# EasyEDA schematic SCH-CJ4-autopilot-v2.json
TITLE: WT Cessna Citation CJ 4 Autopilot; REV: 1.0; Date: 2021-02-20; Sheet: 1/1; Drawn By: tuomas.kuosmanen; Company: Your Company
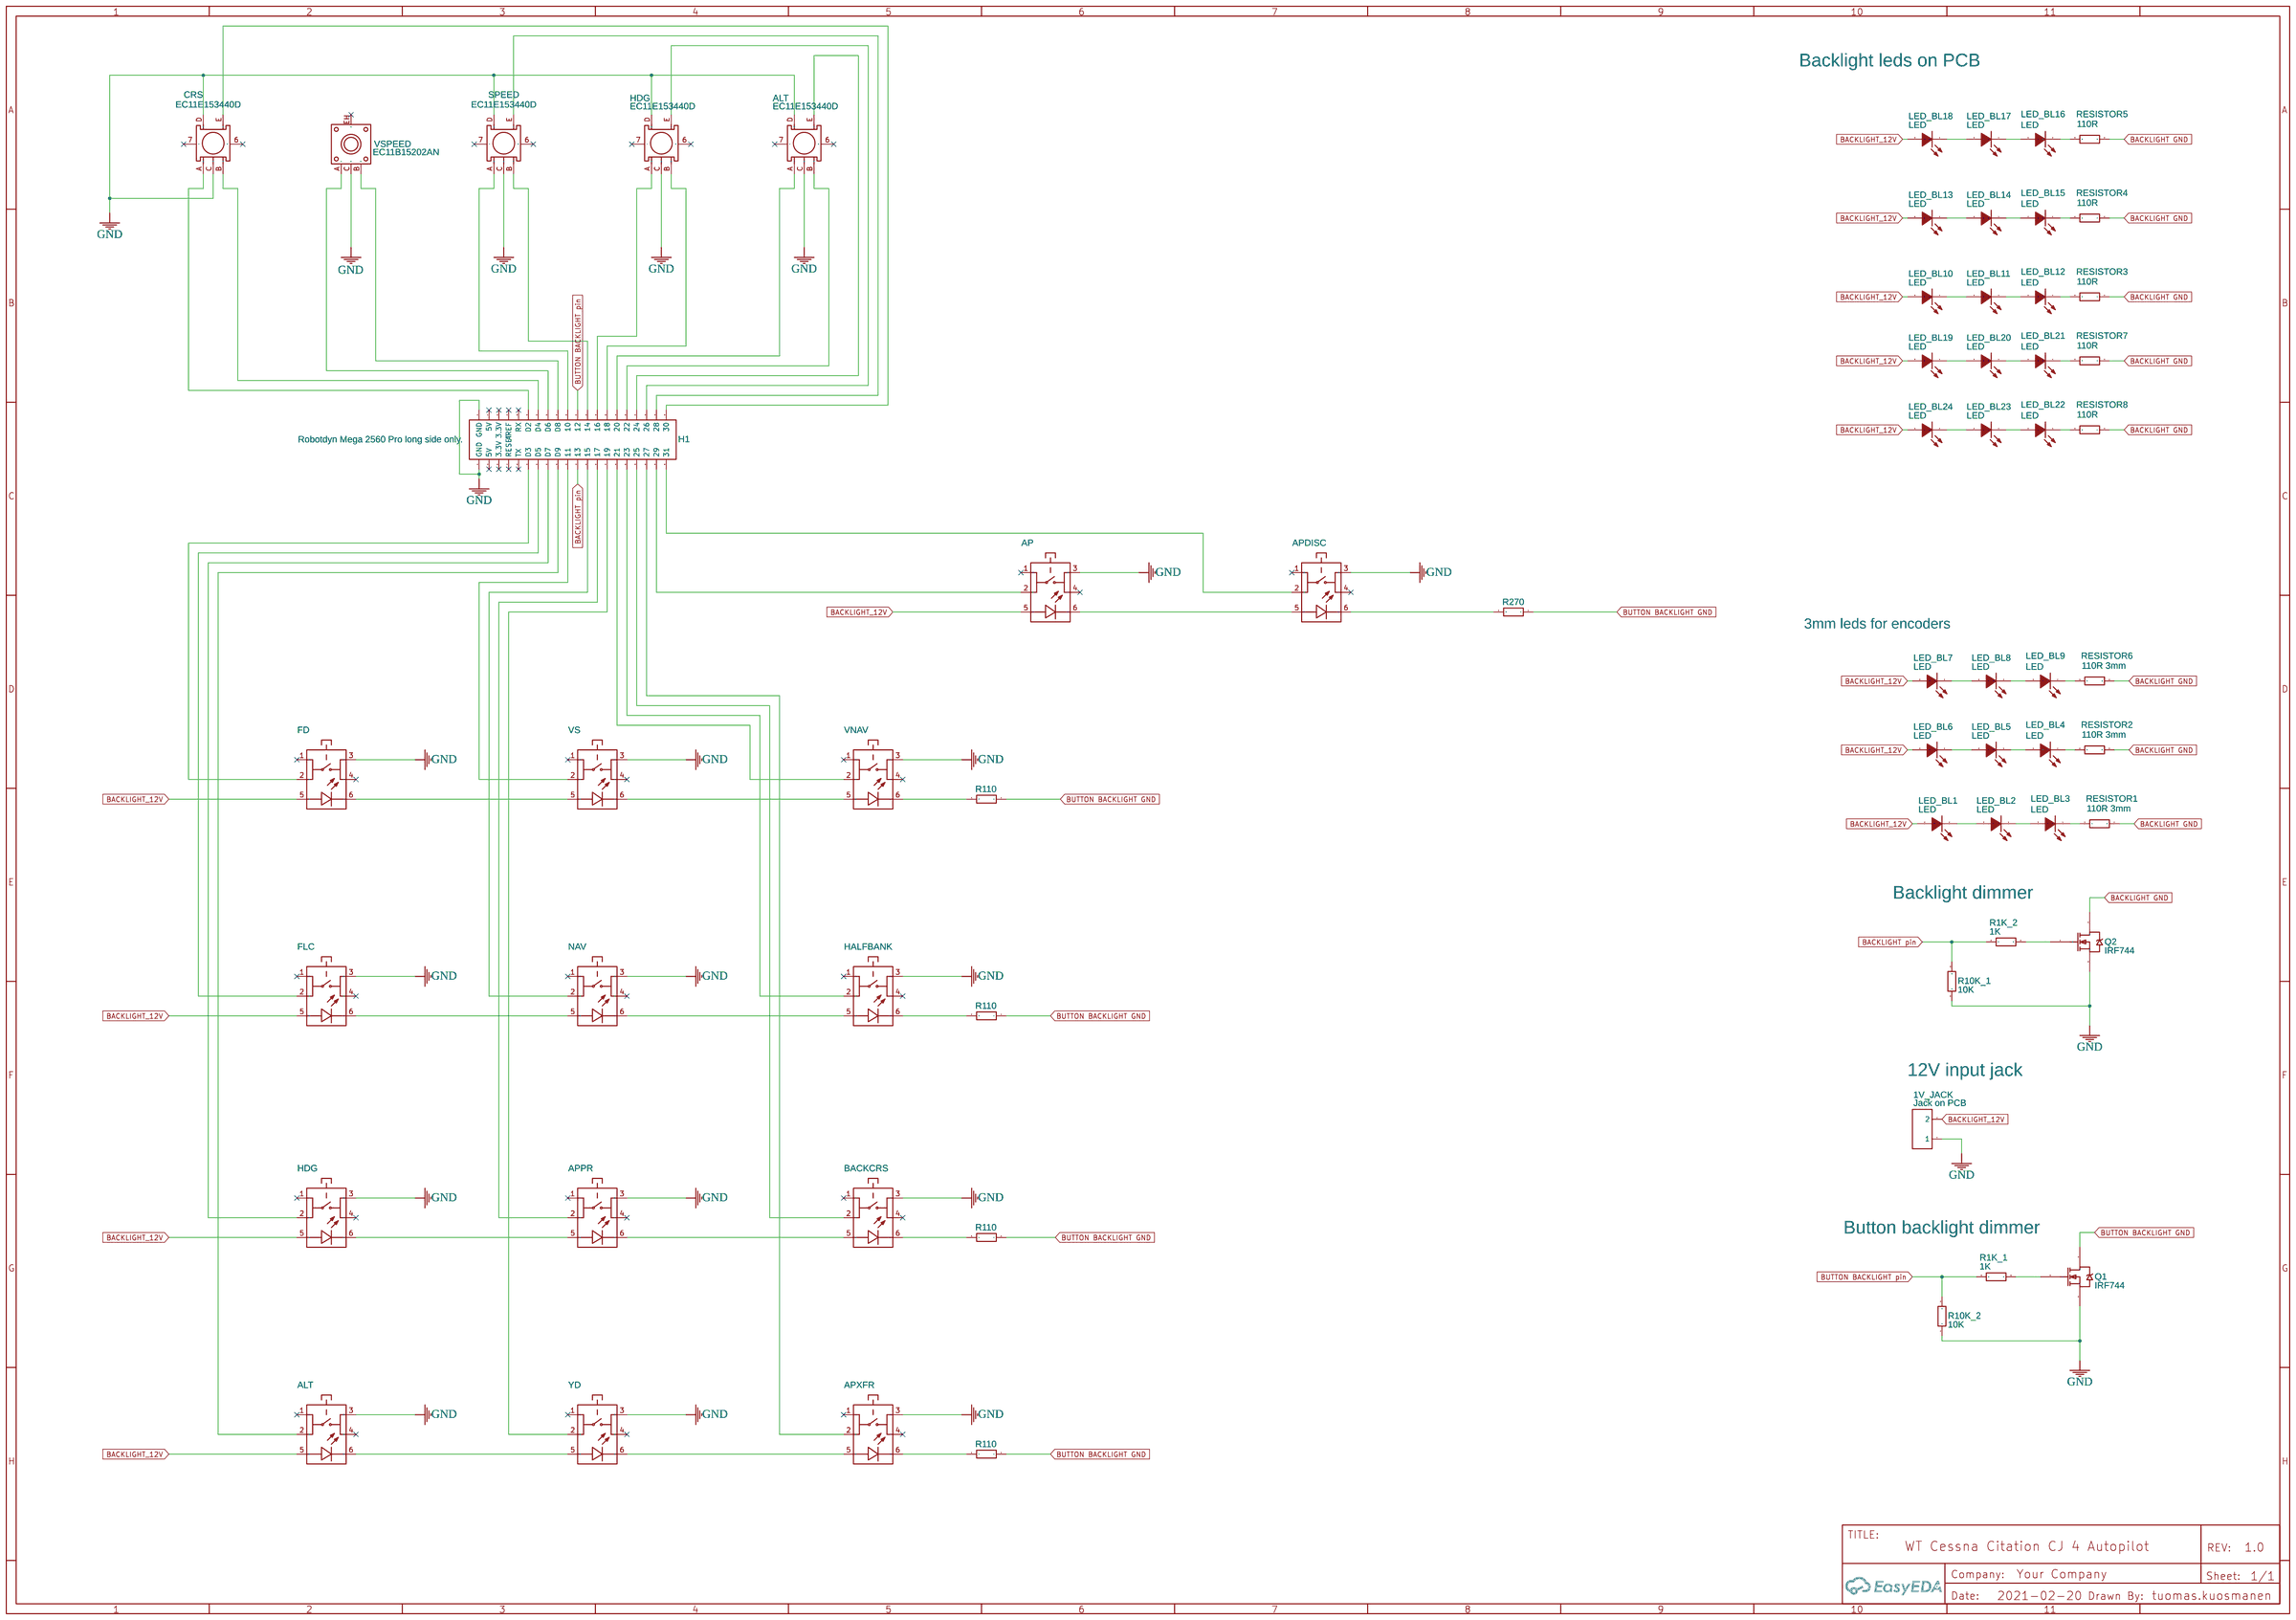
[diagram p0: schematic sheet]

## Parts
1V_JACK  Jack on PCB  [JACK ON PCB]
ALT  EC11E153440D  [SW-TH_EC11XXXXXXXX]
CRS  EC11E153440D  [SW-TH_EC11XXXXXXXX]
H1  Robotdyn Mega 2560 Pro long side only.  [HDR-TH_40P-P2.54-V-M-R2-C20-S2.54]
HDG  EC11E153440D  [SW-TH_EC11XXXXXXXX]
HEADING_HOLD1  FD  [MULTIMEC 3FTH980 - KEY SWITCH, 50 MA, 24 VDC, MEC]
HEADING_HOLD2  FLC  [MULTIMEC 3FTH980 - KEY SWITCH, 50 MA, 24 VDC, MEC]
HEADING_HOLD3  NAV  [MULTIMEC 3FTH980 - KEY SWITCH, 50 MA, 24 VDC, MEC]
HEADING_HOLD4  VS  [MULTIMEC 3FTH980 - KEY SWITCH, 50 MA, 24 VDC, MEC]
HEADING_HOLD5  HALFBANK  [MULTIMEC 3FTH980 - KEY SWITCH, 50 MA, 24 VDC, MEC]
HEADING_HOLD6  VNAV  [MULTIMEC 3FTH980 - KEY SWITCH, 50 MA, 24 VDC, MEC]
HEADING_HOLD7  HDG  [MULTIMEC 3FTH980 - KEY SWITCH, 50 MA, 24 VDC, MEC]
HEADING_HOLD8  APPR  [MULTIMEC 3FTH980 - KEY SWITCH, 50 MA, 24 VDC, MEC]
HEADING_HOLD9  BACKCRS  [MULTIMEC 3FTH980 - KEY SWITCH, 50 MA, 24 VDC, MEC]
HEADING_HOLD10  ALT  [MULTIMEC 3FTH980 - KEY SWITCH, 50 MA, 24 VDC, MEC]
HEADING_HOLD11  YD  [MULTIMEC 3FTH980 - KEY SWITCH, 50 MA, 24 VDC, MEC]
HEADING_HOLD12  APXFR  [MULTIMEC 3FTH980 - KEY SWITCH, 50 MA, 24 VDC, MEC]
HEADING_HOLD13  AP  [MULTIMEC 3FTH980 - KEY SWITCH, 50 MA, 24 VDC, MEC]
HEADING_HOLD14  APDISC  [MULTIMEC 3FTH980 - KEY SWITCH, 50 MA, 24 VDC, MEC]
LED_BL1  LED  [LED-3MM/2.54]
LED_BL2  LED  [LED-3MM/2.54]
LED_BL3  LED  [LED-3MM/2.54]
LED_BL4  LED  [LED-3MM/2.54]
LED_BL5  LED  [LED-3MM/2.54]
LED_BL6  LED  [LED-3MM/2.54]
LED_BL7  LED  [LED1206-RD]
LED_BL8  LED  [LED-3MM/2.54]
LED_BL9  LED  [LED-3MM/2.54]
LED_BL10  LED  [LED1206-RD]
LED_BL11  LED  [LED1206-RD]
LED_BL12  LED  [LED1206-RD]
LED_BL13  LED  [LED1206-RD]
LED_BL14  LED  [LED1206-RD]
LED_BL15  LED  [LED1206-RD]
LED_BL16  LED  [LED1206-RD]
LED_BL17  LED  [LED1206-RD]
LED_BL18  LED  [LED1206-RD]
LED_BL19  LED  [LED1206-RD]
LED_BL20  LED  [LED1206-RD]
LED_BL21  LED  [LED1206-RD]
LED_BL22  LED  [LED1206-RD]
LED_BL23  LED  [LED1206-RD]
LED_BL24  LED  [LED1206-RD]
Q1  IRF744  [TO-220AB]
Q2  IRF744  [TO-220AB]
R1K_1  1K  [R1206]
R1K_2  1K  [R1206]
R10K_1  10K  [R1206]
R10K_2  10K  [R1206]
R_BL1  R110  [R1206]
R_BL2  R110  [R1206]
R_BL3  R110  [R1206]
R_BL4  R270  [R1206]
R_BL5  R110  [R1206]
RESISTOR1  110R 3mm  [R1206]
RESISTOR2  110R 3mm  [R1206]
RESISTOR3  110R  [R1206]
RESISTOR4  110R  [R1206]
RESISTOR5  110R  [R1206]
RESISTOR6  110R 3mm  [R1206]
RESISTOR7  110R  [R1206]
RESISTOR8  110R  [R1206]
SPEED  EC11E153440D  [SW-TH_EC11XXXXXXXX]
VSPEED  EC11B15202AN  [SW-TH_EC11B15202AN]

## Library data of the parts
1V_JACK = J-Header-Male-2.54_1x2: Manufacturer: TE Connectivity; image: //image.lceda.cn/szlcsc/C86471.jpg; link: //image.lceda.cn/szlcsc/C86471.jpg; Package Display: No
ALT CRS HDG SPEED = EC11E153440D: Supplier: LCSC; Supplier Part: C370992; Manufacturer: ALPS Electric; Contributor: LCSC
H1 = Header-Male-2.54_2x20: Supplier: LCSC; Manufacturer: ReliaPro; Supplier Part: C50980; JLCPCB Part Class: Extended Part
HEADING_HOLD1-HEADING_HOLD14 = MULTIMEC 3FTH980 - Key Switch, 50 mA, 24 VDC, MEC: Manufacturer Part: 1052612; link: https://www.elfadistrelec.no/Web/Downloads/he/et/3A3F4F_eng_datasheet.pdf; Contributor: smund3
LED_BL1-LED_BL24 = HQ17-2102UYOC: Supplier: LCSC; Manufacturer: HARVATEK; Contributor: LCSC; Supplier Part: C154481; JLCPCB Part Class: Extended Part
Q1 Q2 = IRF744: HEXFET N-Channel Power MOSFET
R1K_1 R1K_2 R10K_1 R10K_2 R_BL1-R_BL5 RESISTOR1-RESISTOR8 = 1206W4J0331T5E: Supplier: LCSC; Manufacturer: UniOhm; Supplier Part: C25374
VSPEED = EC11B15202AN: Supplier: LCSC; Supplier Part: C470697; Manufacturer: ALPS Electric; Contributor: LCSC

## Nets
GND: 1V_JACK.1 ALT.C ALT.D CRS.C CRS.D H1.1(GND) H1.2(GND) HDG.C HDG.D HEADING_HOLD1.3 HEADING_HOLD2.3 HEADING_HOLD3.3 HEADING_HOLD4.3 HEADING_HOLD5.3 HEADING_HOLD6.3 HEADING_HOLD7.3 HEADING_HOLD8.3 HEADING_HOLD9.3 HEADING_HOLD10.3 HEADING_HOLD11.3 HEADING_HOLD12.3 HEADING_HOLD13.3 HEADING_HOLD14.3 Q1.3(S) Q2.3(S) R10K_1.1 R10K_2.1 SPEED.C SPEED.D VSPEED.C
BACKLIGHT GND: Q2.2(D) RESISTOR1.1 RESISTOR2.1 RESISTOR3.1 RESISTOR4.1 RESISTOR5.1 RESISTOR6.1 RESISTOR7.1 RESISTOR8.1
BACKLIGHT pin: H1.21(13) R1K_2.2 R10K_1.2
BACKLIGHT_12V: 1V_JACK.2 HEADING_HOLD1.5(2) HEADING_HOLD2.5(2) HEADING_HOLD7.5(2) HEADING_HOLD10.5(2) HEADING_HOLD13.5(2) LED_BL1.2(A) LED_BL6.2(A) LED_BL7.2(A) LED_BL10.2(A) LED_BL13.2(A) LED_BL18.2(A) LED_BL19.2(A) LED_BL24.2(A)
BUTTON BACKLIGHT GND: Q1.2(D) R_BL1.1 R_BL2.1 R_BL3.1 R_BL4.1 R_BL5.1
BUTTON BACKLIGHT pin: H1.22(12) R1K_1.2 R10K_2.2
Net-(ALT-A): ALT.A H1.30(20)
Net-(ALT-B): ALT.B H1.32(22)
Net-(ALT-E): ALT.E H1.34(24)
Net-(CRS-A): CRS.A H1.12(D2)
Net-(CRS-B): CRS.B H1.14(D4)
Net-(CRS-E): CRS.E H1.40(30)
Net-(H1-11): H1.11(D3) HEADING_HOLD1.2
Net-(H1-13): H1.13(D5) HEADING_HOLD2.2
Net-(H1-15): H1.15(D7) HEADING_HOLD7.2
Net-(H1-16): H1.16(D6) VSPEED.A
Net-(H1-17): H1.17(D9) HEADING_HOLD10.2
Net-(H1-18): H1.18(D8) VSPEED.B
Net-(H1-19): H1.19(11) HEADING_HOLD4.2
Net-(H1-20): H1.20(10) SPEED.A
Net-(H1-23): H1.23(15) HEADING_HOLD3.2
Net-(H1-24): H1.24(14) SPEED.B
Net-(H1-25): H1.25(17) HEADING_HOLD8.2
Net-(H1-26): H1.26(16) HDG.A
Net-(H1-27): H1.27(19) HEADING_HOLD11.2
Net-(H1-28): H1.28(18) HDG.B
Net-(H1-29): H1.29(21) HEADING_HOLD6.2
Net-(H1-31): H1.31(23) HEADING_HOLD5.2
Net-(H1-33): H1.33(25) HEADING_HOLD9.2
Net-(H1-35): H1.35(27) HEADING_HOLD12.2
Net-(H1-36): H1.36(26) HDG.E
Net-(H1-37): H1.37(29) HEADING_HOLD13.2
Net-(H1-38): H1.38(28) SPEED.E
Net-(H1-39): H1.39(31) HEADING_HOLD14.2
Net-(HEADING_HOLD1-6): HEADING_HOLD1.6(4) HEADING_HOLD4.5(2)
Net-(HEADING_HOLD2-6): HEADING_HOLD2.6(4) HEADING_HOLD3.5(2)
Net-(HEADING_HOLD3-6): HEADING_HOLD3.6(4) HEADING_HOLD5.5(2)
Net-(HEADING_HOLD4-6): HEADING_HOLD4.6(4) HEADING_HOLD6.5(2)
Net-(HEADING_HOLD5-6): HEADING_HOLD5.6(4) R_BL1.2
Net-(HEADING_HOLD6-6): HEADING_HOLD6.6(4) R_BL5.2
Net-(HEADING_HOLD7-6): HEADING_HOLD7.6(4) HEADING_HOLD8.5(2)
Net-(HEADING_HOLD8-6): HEADING_HOLD8.6(4) HEADING_HOLD9.5(2)
Net-(HEADING_HOLD9-6): HEADING_HOLD9.6(4) R_BL2.2
Net-(HEADING_HOLD10-6): HEADING_HOLD10.6(4) HEADING_HOLD11.5(2)
Net-(HEADING_HOLD11-6): HEADING_HOLD11.6(4) HEADING_HOLD12.5(2)
Net-(HEADING_HOLD12-6): HEADING_HOLD12.6(4) R_BL3.2
Net-(HEADING_HOLD13-6): HEADING_HOLD13.6(4) HEADING_HOLD14.5(2)
Net-(HEADING_HOLD14-6): HEADING_HOLD14.6(4) R_BL4.2
Net-(LED_BL1-1): LED_BL1.1(K) LED_BL2.2(A)
Net-(LED_BL2-1): LED_BL2.1(K) LED_BL3.2(A)
Net-(LED_BL3-1): LED_BL3.1(K) RESISTOR1.2
Net-(LED_BL4-1): LED_BL4.1(K) RESISTOR2.2
Net-(LED_BL4-2): LED_BL4.2(A) LED_BL5.1(K)
Net-(LED_BL5-2): LED_BL5.2(A) LED_BL6.1(K)
Net-(LED_BL7-1): LED_BL7.1(K) LED_BL8.2(A)
Net-(LED_BL8-1): LED_BL8.1(K) LED_BL9.2(A)
Net-(LED_BL9-1): LED_BL9.1(K) RESISTOR6.2
Net-(LED_BL10-1): LED_BL10.1(K) LED_BL11.2(A)
Net-(LED_BL11-1): LED_BL11.1(K) LED_BL12.2(A)
Net-(LED_BL12-1): LED_BL12.1(K) RESISTOR3.2
Net-(LED_BL13-1): LED_BL13.1(K) LED_BL14.2(A)
Net-(LED_BL14-1): LED_BL14.1(K) LED_BL15.2(A)
Net-(LED_BL15-1): LED_BL15.1(K) RESISTOR4.2
Net-(LED_BL16-1): LED_BL16.1(K) RESISTOR5.2
Net-(LED_BL16-2): LED_BL16.2(A) LED_BL17.1(K)
Net-(LED_BL17-2): LED_BL17.2(A) LED_BL18.1(K)
Net-(LED_BL19-1): LED_BL19.1(K) LED_BL20.2(A)
Net-(LED_BL20-1): LED_BL20.1(K) LED_BL21.2(A)
Net-(LED_BL21-1): LED_BL21.1(K) RESISTOR7.2
Net-(LED_BL22-1): LED_BL22.1(K) RESISTOR8.2
Net-(LED_BL22-2): LED_BL22.2(A) LED_BL23.1(K)
Net-(LED_BL23-2): LED_BL23.2(A) LED_BL24.1(K)
Net-(Q1-1): Q1.1(G) R1K_1.1
Net-(Q2-1): Q2.1(G) R1K_2.1

Not connected (* = marked no-connect by the designer): ALT 6* 7*; CRS 6* 7*; H1 3(5V)* 4(5V)* 5(3.3V)* 6(3.3V)* 7(RESET)* 8(AREF)* 9(TX)* 10(RX)*; HDG 6* 7*; HEADING_HOLD1 1* 4*; HEADING_HOLD2 1* 4*; HEADING_HOLD3 1* 4*; HEADING_HOLD4 1* 4*; HEADING_HOLD5 1* 4*; HEADING_HOLD6 1* 4*; HEADING_HOLD7 1* 4*; HEADING_HOLD8 1* 4*; HEADING_HOLD9 1* 4*; HEADING_HOLD10 1* 4*; HEADING_HOLD11 1* 4*; HEADING_HOLD12 1* 4*; HEADING_HOLD13 1* 4*; HEADING_HOLD14 1* 4*; SPEED 6* 7*; VSPEED EH*

## Notes on the sheet
- Backlight leds on PCB
- 3mm leds for encoders
- Backlight dimmer
- 12V input jack
- Button backlight dimmer
